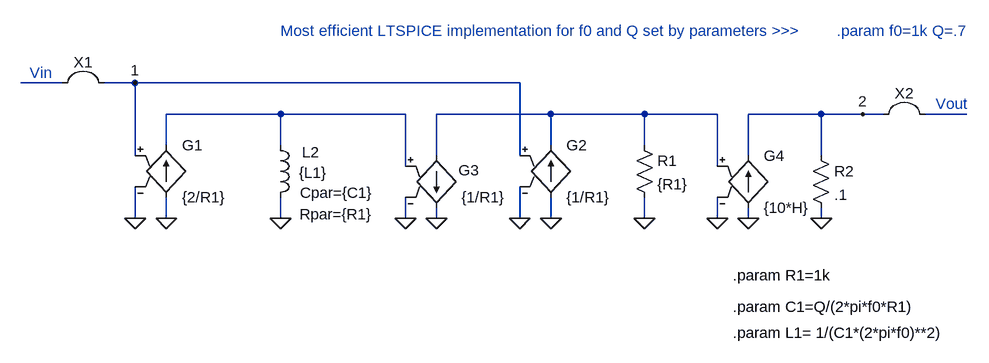
[diagram p0: schematic 2ndOrderAllpass.asc]
2ndOrderAllpass.asc, the LTspice schematic file:
Version 4
SHEET 1 1060 680
WIRE -784 -176 -848 -176
WIRE -672 -176 -720 -176
WIRE -80 -176 -672 -176
WIRE -448 -128 -624 -128
WIRE -256 -128 -448 -128
WIRE -32 -128 -208 -128
WIRE 112 -128 -32 -128
WIRE 224 -128 112 -128
WIRE 384 -128 272 -128
WIRE 448 -128 384 -128
WIRE 480 -128 448 -128
WIRE 608 -128 544 -128
WIRE -624 -80 -624 -128
WIRE -448 -80 -448 -128
WIRE -32 -80 -32 -128
WIRE 112 -80 112 -128
WIRE -672 -64 -672 -176
WIRE -208 -64 -208 -128
WIRE -80 -64 -80 -176
WIRE 272 -64 272 -128
WIRE 384 -64 384 -128
WIRE -256 -48 -256 -128
WIRE 224 -48 224 -128
WIRE -672 32 -672 -16
WIRE -624 32 -624 0
WIRE -448 32 -448 0
WIRE -256 32 -256 0
WIRE -208 32 -208 16
WIRE -80 32 -80 -16
WIRE -32 32 -32 0
WIRE 112 32 112 0
WIRE 224 32 224 0
WIRE 272 32 272 16
WIRE 384 32 384 16
FLAG -624 32 0
FLAG -672 32 0
FLAG -448 32 0
FLAG -32 32 0
FLAG -80 32 0
FLAG -256 32 0
FLAG 112 32 0
FLAG -208 32 0
FLAG -672 -176 1
FLAG 224 32 0
FLAG 272 32 0
FLAG 384 32 0
FLAG 448 -128 2
SYMBOL g -624 -96 R0
SYMATTR InstName G1
SYMATTR Value {2/R1}
SYMBOL ind -464 -96 R0
WINDOW 0 49 27 Left 2
WINDOW 3 44 58 Left 2
WINDOW 39 46 89 Left 2
WINDOW 123 45 122 Left 2
SYMATTR InstName L2
SYMATTR Value {L1}
SYMATTR SpiceLine Cpar={C1}
SYMATTR Value2 Rpar={R1}
SYMBOL g -32 -96 R0
SYMATTR InstName G2
SYMATTR Value {1/R1}
SYMBOL g2 -208 32 M180
WINDOW 0 34 74 Left 2
WINDOW 3 38 32 Left 2
SYMATTR InstName G3
SYMATTR Value {1/R1}
SYMBOL res 96 -96 R0
SYMATTR InstName R1
SYMATTR Value {R1}
SYMBOL Misc\\jumper -752 -240 M0
SYMATTR InstName X1
SYMBOL g 272 -80 R0
SYMATTR InstName G4
SYMATTR Value {10*H}
SYMBOL res 368 -80 R0
SYMATTR InstName R2
SYMATTR Value .1
SYMBOL Misc\\jumper 512 -192 R0
SYMATTR InstName X2
TEXT 408 -256 Left 2 ;.param f0=1k Q=.7
TEXT -448 -256 Left 2 ;Most efficient LTSPICE implementation for f0 and Q set by parameters >>>
TEXT 248 120 Left 2 !.param R1=1k
TEXT 248 168 Left 2 !.param C1=Q/(2*pi*f0*R1)
TEXT 248 208 Left 2 !.param L1= 1/(C1*(2*pi*f0)**2)
TEXT -800 -192 Right 2 ;Vin
TEXT 560 -144 Left 2 ;Vout

The netlist it stands for:
* 2ndOrderAllpass.asc
G1 0 N001 1 0 {2/R1}
L2 N001 0 {L1} Rpar={R1} Cpar={C1}
G2 0 N002 1 0 {1/R1}
G3 N002 0 N001 0 {1/R1}
R1 N002 0 {R1}
G4 0 2 N002 0 {10*H}
R2 2 0 .1
* .param f0=1k Q=.7
* Most efficient LTSPICE implementation for f0 and Q set by parameters >>>
.param R1=1k
.param C1=Q/(2*pi*f0*R1)
.param L1= 1/(C1*(2*pi*f0)**2)
* Vin
* Vout
.backanno
.end